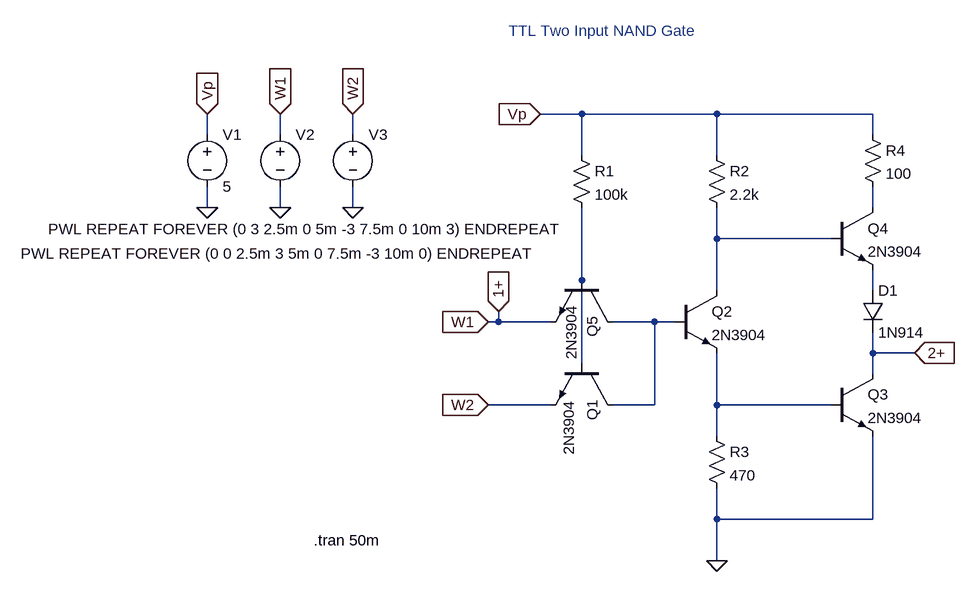
[diagram p0: schematic ttl_two_in_nand_ltspice.asc]
ttl_two_in_nand_ltspice.asc, the LTspice schematic file:
Version 4
SHEET 1 880 680
WIRE 144 -224 80 -224
WIRE 352 -224 144 -224
WIRE 592 -224 352 -224
WIRE -432 -192 -432 -224
WIRE -320 -192 -320 -224
WIRE -208 -192 -208 -224
WIRE 592 -192 592 -224
WIRE 144 -160 144 -224
WIRE 352 -160 352 -224
WIRE -432 -80 -432 -112
WIRE -320 -80 -320 -112
WIRE -208 -80 -208 -112
WIRE 592 -80 592 -112
WIRE 352 -32 352 -80
WIRE 528 -32 352 -32
WIRE 144 32 144 -80
WIRE 352 48 352 -32
WIRE 592 48 592 16
WIRE 16 96 16 80
WIRE 16 96 0 96
WIRE 96 96 16 96
WIRE 256 96 192 96
WIRE 288 96 256 96
WIRE 592 144 592 112
WIRE 656 144 592 144
WIRE 144 160 144 32
WIRE 592 176 592 144
WIRE 96 224 0 224
WIRE 256 224 256 96
WIRE 256 224 192 224
WIRE 352 224 352 144
WIRE 528 224 352 224
WIRE 352 272 352 224
WIRE 352 400 352 352
WIRE 592 400 592 272
WIRE 592 400 352 400
WIRE 352 464 352 400
FLAG 352 464 0
FLAG 80 -224 Vp
IOPIN 80 -224 In
FLAG 0 96 W1
IOPIN 0 96 In
FLAG 0 224 W2
IOPIN 0 224 In
FLAG 16 80 1+
IOPIN 16 80 In
FLAG 656 144 2+
IOPIN 656 144 In
FLAG -432 -80 0
FLAG -320 -80 0
FLAG -208 -80 0
FLAG -432 -224 Vp
IOPIN -432 -224 In
FLAG -320 -224 W1
IOPIN -320 -224 In
FLAG -208 -224 W2
IOPIN -208 -224 In
SYMBOL npn 192 160 R90
SYMATTR InstName Q1
SYMATTR Value 2N3904
SYMBOL npn 288 48 R0
SYMATTR InstName Q2
SYMATTR Value 2N3904
SYMBOL npn 528 176 R0
SYMATTR InstName Q3
SYMATTR Value 2N3904
SYMBOL npn 528 -80 R0
SYMATTR InstName Q4
SYMATTR Value 2N3904
SYMBOL npn 192 32 R90
WINDOW 3 37 64 Left 2
SYMATTR InstName Q5
SYMATTR Value 2N3904
SYMBOL res 128 -176 R0
SYMATTR InstName R1
SYMATTR Value 100k
SYMBOL res 336 -176 R0
SYMATTR InstName R2
SYMATTR Value 2.2k
SYMBOL res 336 256 R0
SYMATTR InstName R3
SYMATTR Value 470
SYMBOL res 576 -208 R0
SYMATTR InstName R4
SYMATTR Value 100
SYMBOL diode 576 48 R0
SYMATTR InstName D1
SYMATTR Value 1N914
SYMBOL voltage -432 -208 R0
WINDOW 123 0 0 Left 0
WINDOW 39 0 0 Left 0
SYMATTR InstName V1
SYMATTR Value 5
SYMBOL voltage -320 -208 R0
WINDOW 3 -399 199 Left 2
WINDOW 123 0 0 Left 0
WINDOW 39 0 0 Left 0
SYMATTR InstName V2
SYMATTR Value PWL REPEAT FOREVER (0 0 2.5m 3 5m 0 7.5m -3 10m 0) ENDREPEAT
SYMBOL voltage -208 -208 R0
WINDOW 3 -469 161 Left 2
WINDOW 123 0 0 Left 0
WINDOW 39 0 0 Left 0
SYMATTR InstName V3
SYMATTR Value PWL REPEAT FOREVER (0 3 2.5m 0 5m -3 7.5m 0 10m 3) ENDREPEAT
TEXT -268 432 Left 2 !.tran 50m
TEXT 32 -352 Left 2 ;TTL Two Input NAND Gate

The netlist it stands for:
* ttl_two_in_nand_ltspice.asc
Q1 N005 N003 W2 0 2N3904
Q2 N002 N005 N006 0 2N3904
Q3 2+ N006 0 0 2N3904
Q4 N001 N002 N004 0 2N3904
Q5 N005 N003 1+ 0 2N3904
R1 Vp N003 100k
R2 Vp N002 2.2k
R3 N006 0 470
R4 Vp N001 100
D1 N004 2+ 1N914
V1 Vp 0 5
V2 1+ 0 PWL REPEAT FOREVER (0 0 2.5m 3 5m 0 7.5m -3 10m 0) ENDREPEAT
V3 W2 0 PWL REPEAT FOREVER (0 3 2.5m 0 5m -3 7.5m 0 10m 3) ENDREPEAT
.model D D
.lib standard.dio
.model NPN NPN
.model PNP PNP
.lib standard.bjt
.tran 50m
* TTL Two Input NAND Gate
.backanno
.end